# Altium schematic sheet 11-NCP3063_LCD背光.SchDoc
size A4; DocumentNumber: 30; SheetNumber: 30; SheetTotal: 30
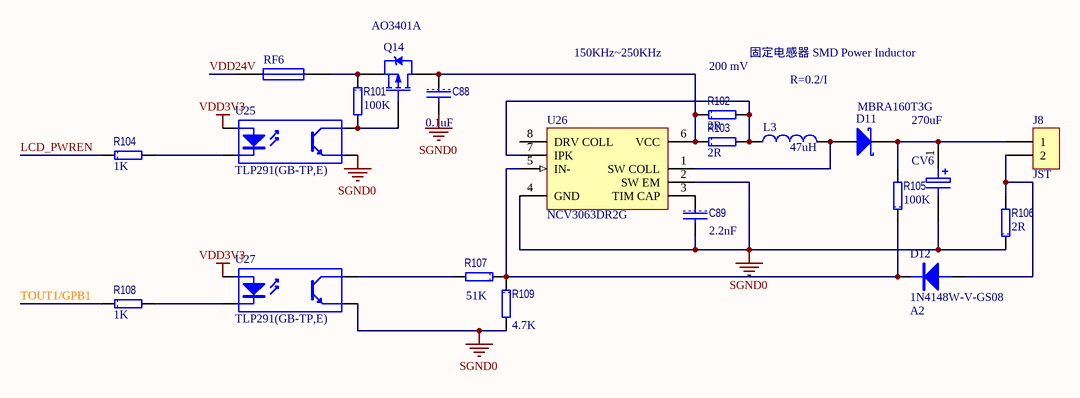
[diagram p0: 11-NCP3063_LCD背光.SchDoc]

## Parts
C88  value 0.1uF  [1608[0603]C]  (hidden comment: C1608X7R1H104K)
C89  value 2.2nF  [1608[0603]C]  (hidden comment: C1608X7R1H222K)
CV6  value 270uF  [CAPPR5-10x20/H1.1]  (hidden comment: EEU-FM1H271)
D11  MBRA160T3G  [DO-214AC/SMA]
D12  1N4148W-V-GS08  value A2  [SOD323]
J8  JST  [JST]
L3  value 47uH  [INDP5050X28N]  (hidden comment: CDRH5D28RH125NP-470MC)
Q14  AO3401A  [SOT23_N]
R101  value 100K  [1608[0603]R]  (hidden comment: CRCW0603100KFKEA)
R102  value 2R  [1608[0603]R]  (hidden comment: CRCW06032R00FKEA)
R103  value 2R  [1608[0603]R]  (hidden comment: CRCW06032R00FKEA)
R104  value 1K  [1608[0603]R]  (hidden comment: CRCW06031K00FKEA)
R105  value 100K  [1608[0603]R]  (hidden comment: CRCW0603100KFKEA)
R106  value 2R  [1608[0603]R]  (hidden comment: CRCW06032R00FKEA)
R107  value 51K  [1608[0603]R]  (hidden comment: CRCW060351K0FKEA)
R108  value 1K  [1608[0603]R]  (hidden comment: CRCW06031K00FKEA)
R109  value 4.7K  [1608[0603]R]  (hidden comment: CRCW06034K70FKEA)
RF6  1206L016WR  [3216[1206]]  (value not drawn)
U25  TLP291(GB-TP,E)  [SSOP4_N]
U26  NCV3063DR2G  [SOIC8_N]
U27  TLP291(GB-TP,E)  [SSOP4_N]

## Nets
SGND0: C88.2 C89.2 CV6.2 R106.1 R109.2 U25.3(E) U26.2(SW_EM) U26.4(GND) U27.3(E)
VDD3V3: U25.1(A) U27.1(A)
LCD_PWREN: R104.1
TOUT1/GPB1: R108.1
VDD24V: RF6.1
NetC88_1: C88.1 Q14.3(D) R102.1 R103.1 U26.6(VCC)
NetC89_1: C89.1 U26.3(TIM_CAP)
NetCV6_1: CV6.1 D11.2(K) J8.1 R105.2
NetD11_1: D11.1(A) L3.2 U26.1(SW_COLL)
NetD12_1: D12.1(A) J8.2 R106.2
NetD12_2: D12.2(K) R105.1 R107.1 R109.1 U26.5(IN-)
NetL3_1: L3.1 R102.2 R103.2 U26.7(IPK)
NetQ14_1: Q14.1(G) R101.2 U25.4(C)
NetQ14_2: Q14.2(S) R101.1 RF6.2
NetR104_2: R104.2 U25.2(K)
NetR107_2: R107.2 U27.4(C)
NetR108_2: R108.2 U27.2(K)

Not connected (* = marked no-connect by the designer): U26 8(DRV_COLL)

## Notes on the sheet
- 150KHz~250KHz
- (near R102) 200 mV
- R=0.2/I

## Library data of the parts
C88 = CAP: 多层陶瓷电容器MLCC - SMD/SMT 0603 0.1uF 50volts X7R 10%; Manufacturer: TDK; 产品: General Type MLCCs; 产品种类: Low & Medium Capacitance SMD Ceramic Chip Capacitors; 外壳代码 - in: 0603; 外壳代码 - mm: 1608; 封装 / 箱体: 0603 (1608 metric); 封装: Reel; 尺寸: 0.8 mm W x 1.6 mm L x 0.8 mm H; 工作温度范围: - 55 C to + 125 C; 标准包装数量: 4000; 电压额定值: 50 V; 电容-nF: 100 nF; 电容-pF: 100000 pF; 系列: C; Category: 多层陶瓷电容器MLCC - SMD/SMT; ComponentLink1Description: http://www.tdk.com/pdf/general_B11.pdf; ComponentLink1URL: http://www.tdk.com/pdf/general_B11.pdf; Description 1: 多层陶瓷电容器MLCC - SMD/SMT 0603 0.1uF 50volts X7R 10%; Manufacturer Part Number: C1608X7R1H104K; Minimum Order Quantity: 1; Pricing 1: 1=0.160, 50=0.070, 100=0.036, 500=0.019, 1000=0.013, 4000=0.010, 8000=0.009, 12000=0.008, 20000=0.007 (USD); Reeling: True; RoHS - 贸泽: Y; RoHS: RoHS Compliant; Stock 1: 224604; Supplier 1: Mouser; Supplier Part Number 1: 810-C1608X7R1H104K; 制造商: TDK; 容差: 10 %; 温度系数/代码: X7R; 电容: 0.1 uF; 端接类型: SMD/SMT
C89 = CAP: 多层陶瓷电容器MLCC - SMD/SMT 0603 2200pF 50volts X7R 10%; Manufacturer: TDK; 尺寸: 0.8 mm W x 1.6 mm L x 0.8 mm H; 工作温度范围: - 55 C to + 125 C; 封装 / 箱体: 0603 (1608 metric); 封装: Reel; 产品: General Type MLCCs; 系列: C; 电压额定值: 50 V; 电容-nF: 2.2 nF; 电容-uF: 0.0022 uF; 外壳代码 - in: 0603; 外壳代码 - mm: 1608; 产品种类: Low & Medium Capacitance SMD Ceramic Chip Capacitors; 标准包装数量: 4000; Product Status: End of Life; Supplier 1: Mouser; Supplier Part Number 1: 810-C1608X7R1H222K; Manufacturer Part Number: C1608X7R1H222K; RoHS: RoHS Compliant; Description 1: 多层陶瓷电容器MLCC - SMD/SMT 0603 2200pF 50volts X7R 10%; Category: 多层陶瓷电容器MLCC - SMD/SMT; Stock 1: 3940; Pricing 1: 1=0.100, 50=0.020, 100=0.014, 500=0.010, 1000=0.007, 4000=0.006, 8000=0.005, 20000=0.004 (USD); 电容: 2200 pF; 端接类型: SMD/SMT; 容差: 10 %; 制造商: TDK; 温度系数/代码: X7R; RoHS - 贸泽: Y; Minimum Order Quantity: 1; Reeling: True; ComponentLink1URL: http://www.tdk.com/pdf/general_B11.pdf; ComponentLink1Description: http://www.tdk.com/pdf/general_B11.pdf
CV6 = ELECTRO1: 插针 铝质电解电容器 - 带引线 270UF 50V ELECT FM RADIAL; Manufacturer: Panasonic Electronic Components; 工作温度范围: - 40 C to + 105 C; 封装: Bulk; 产品: Low Impedance Electrolytic Capacitors; 容差: 20 %; 外壳直径: 10 mm; 外壳长度: 20 mm; 损耗因数 DF: 0.1; 引线间隔: 5 mm; 加载寿命: 5000 hr; 制造商: Panasonic; 纹波电流: 1890 mA; 标准包装数量: 200; Supplier 1: Mouser; Supplier Part Number 1: 667-EEU-FM1H271; Manufacturer Part Number: EEU-FM1H271; RoHS: RoHS Compliant; Description 1: 铝质电解电容器 - 带引线 270UF 50V ELECT FM RADIAL; Category: 铝质电解电容器 - 带引线; Stock 1: 264; Pricing 1: 1=0.370, 25=0.334, 100=0.305, 250=0.281, 500=0.246, 1000=0.226, 2000=0.216, 5000=0.200 (USD); 电容: 270 uF; 系列: FM; 端接类型: Radial; 电压额定值: 50 V; RoHS - 贸泽: Y; Minimum Order Quantity: 1; Reeling: False; ComponentLink1URL: http://www.mouser.com/ds/2/315/ABA0000CE108-5973.pdf; ComponentLink1Description: http://www.mouser.com/ds/2/315/ABA0000CE108-5973.pdf
D11 = 10BQ060: 肖特基二极管与整流器 60 Volt 1.0 A; Manufacturer: ON Semiconductor; Configuration: Single; Forward Continuous Current: 2.1 A; Max Surge Current: 60 A; Forward Voltage Drop: 0.51 V at 1 A; Maximum Reverse Leakage Current: 200 uA; Peak Reverse Voltage: 60 V; Supplier 1: Mouser; Supplier Part Number 1: 863-MBRA160T3G; Manufacturer Part Number: MBRA160T3G; RoHS: RoHS Compliant; Category: Schottky Diodes & Rectifiers; Stock 1: 21130; Pricing 1: 1=0.756, 10=0.502, 100=0.281, 1000=0.211, 5000=0.181, 10000=0.170, 25000=0.155, 50000=0.150, 100000=0.144 (AUD); Operating Temperature Range: - 55 C to + 125 C; Package / Case: SMA; Packaging: Reel; Product: Schottky Diodes; Mounting Style: SMD/SMT; Product Category: Diodes- Schottky; Standard Pack Qty: 5000; RoHS - Mouser: Y; Minimum Order Quantity: 1; Reeling: True; ComponentLink1URL: http://www.mouser.com/ds/2/308/MBRA160T3-D-95572.pdf; ComponentLink1Description: http://www.mouser.com/ds/2/308/MBRA160T3-D-95572.pdf
D12 = 1N4148W: 二极管 - 通用，功率，开关 100V Io/150mA; Manufacturer: Vishay Semiconductors; 配置: Single; 工作温度范围: - 65 C to + 150 C; 封装 / 箱体: SOD-123; 封装: Reel; 产品: Switching Diodes; 正向连续电流: 0.15 A; 最大浪涌电流: 0.5 A; 安装风格: SMD/SMT; 恢复时间: 4 ns; 正向电压下降: 1.2 V; 制造商: Vishay; 最大二极管电容: 4 pF; 最大工作温度: + 150 C; 最大功率耗散: 350 mW; 最大反向漏泄电流: 5 uA; 最小工作温度: - 65 C; 标准包装数量: 15000; Supplier 1: Mouser; Supplier Part Number 1: 625-1N4148W-V; Manufacturer Part Number: 1N4148W-V-GS08; RoHS: RoHS Compliant; Category: 二极管 - 通用，功率，开关; Stock 1: 404148; Pricing 1: 1=0.090, 10=0.083, 50=0.072, 100=0.068, 500=0.032, 1000=0.026, 3000=0.021, 9000=0.016, 10000=0.016, 18000=0.014 (USD); 峰值反向电压: 100 V; 产品种类: Switching Diodes; RoHS - 贸泽: Y; Minimum Order Quantity: 1; Reeling: True; ComponentLink1URL: http://www.mouser.com/ds/2/427/1n4148w--240387.pdf; ComponentLink1Description: http://www.mouser.com/ds/2/427/1n4148w--240387.pdf; Description 1: 二极管 - 通用，功率，开关 100V Io/150mA
J8 = CON2: CON
L3 = Inductor: 固定电感器 SMD Power Inductor; Manufacturer: Sumida; 尺寸: 6.2 mm W x 6.3 mm L x 3 mm H; 电感: 47 uH; 最大直流电流: 0.91 A; 最大直流电阻: 500 mOhms; 工作温度范围: - 40 C to + 125 C; 封装: Reel; 产品: SMD Power Inductors; 系列: CDRH; 屏蔽: Shielded; 端接类型: SMD/SMT; 容差: 20 %; 外壳高度: 3 mm; 外壳长度: 6.3 mm; 外壳宽度: 6.2 mm; Product Status: New Product; Supplier 1: Mouser; Supplier Part Number 1: 851-CDRH5D28RH125470; Manufacturer Part Number: CDRH5D28RH125NP-470MC; RoHS: RoHS Compliant; Description 1: 固定电感器 SMD Power Inductor; Category: 固定电感器; Stock 1: 3441; Pricing 1: 1=0.950, 10=0.920, 100=0.650, 500=0.640, 1000=0.620, 2000=0.600, 4000=0.470 (USD); 制造商: Sumida; RoHS - 贸泽: Y; Minimum Order Quantity: 1; Reeling: True; ComponentLink1URL: http://www.mouser.com/ds/2/390/CDRH5D28RH125-4194.pdf; ComponentLink1Description: http://www.mouser.com/ds/2/390/CDRH5D28RH125-4194.pdf
Q14 = IRLML5103: MOSFET P-CH -30V -4.3A SOT23; Manufacturer: Alpha & Omega Semiconductor Inc; FET Type: MOSFET P-Channel, Metal Oxide; FET Feature: Logic Level Gate, 2.5V Drive; Drain to Source Voltage (Vdss): 30V; Current - Continuous Drain (Id) @ 25° C: 4.3A (Ta); Rds On (Max) @ Id, Vgs: 44 mOhm @ 4.3A, 10V; Vgs(th) (Max) @ Id: 1.3V @ 250μA; Gate Charge (Qg) @ Vgs: 12.2nC @ 4.5V; Input Capacitance (Ciss) @ Vds: 1200pF @ 15V; Power - Max: 1.4W; Supplier 1: Digi-Key; Supplier Part Number 1: 785-1001-6-ND; Manufacturer Part Number: AO3401A; RoHS: RoHS Compliant; Description 1: MOSFET P-CH -30V -4.3A SOT23; Category: Discrete Semiconductor Products; Stock 1: 75922; Pricing 1: 1=0.48, 25=0.2792, 100=0.225, 250=0.162, 500=0.1305, 1000=0.10125 (USD); Packaging: Digi-Reel?; Mounting Type: Surface Mount; Package / Case: TO-236-3, SC-59, SOT-23-3; Supplier Device Package: SOT-23-3; ComponentLink1URL: http://www.aosmd.com/res/data_sheets/AO3401A.pdf; ComponentLink1Description: http://www.aosmd.com/res/data_sheets/AO3401A.pdf
R101 R105 = RES: 厚膜电阻器 - SMD 1/10watt 100Kohms 1%; Manufacturer: Vishay / Dale; 尺寸: 0.85 mm W x 1.55 mm L x 0.45 mm H; 工作温度范围: - 55 C to + 155 C; 封装 / 箱体: 0603 (1608 metric); 封装: Reel; 功率额定值: 100 mW; 产品: Thick Film Resistors SMD; 系列: CRCW; 温度系数: 100 PPM / K; 端接类型: SMD/SMT; 电压额定值: 75 V; 制造商: Vishay; 产品种类: 0603 Thick Film Chip Resistors; 标准包装数量: 5000; 外壳代码 - in: 0603; 外壳代码 - mm: 1608; Supplier 1: Mouser; Supplier Part Number 1: 71-CRCW0603-100K-E3; Manufacturer Part Number: CRCW0603100KFKEA; RoHS: RoHS Compliant By Exemption; Category: 厚膜电阻器 - SMD; Stock 1: 175756; Pricing 1: 1=0.080, 10=0.013, 100=0.010, 1000=0.008, 5000=0.005, 25000=0.004, 50000=0.003 (USD); 电阻: 100 kOhms; 容差: 1 %; RoHS - 贸泽: E; Minimum Order Quantity: 1; Reeling: True; ComponentLink1URL: http://www.mouser.com/ds/2/427/dcrcwe3-109170.pdf; ComponentLink1Description: http://www.mouser.com/ds/2/427/dcrcwe3-109170.pdf; Description 1: 厚膜电阻器 - SMD 1/10watt 100Kohms 1%
R102 R103 R106 = RES: 厚膜电阻器 - SMD 1/10watt 2ohms 1%; Manufacturer: Vishay / Dale; 尺寸: 0.85 mm W x 1.55 mm L x 0.45 mm H; 工作温度范围: - 55 C to + 155 C; 封装 / 箱体: 0603 (1608 metric); 封装: Reel; 功率额定值: 100 mW; 产品: Thick Film Resistors SMD; 系列: CRCW; 温度系数: 100 PPM / K; 端接类型: SMD/SMT; 电压额定值: 75 V; 外壳代码 - in: 0603; 外壳代码 - mm: 1608; 制造商: Vishay; 产品种类: 0603 Thick Film Chip Resistors; Product Status: New at Mouser; Supplier 1: Mouser; Supplier Part Number 1: 71-CRCW06032R00FKEA; Manufacturer Part Number: CRCW06032R00FKEA; RoHS: RoHS Compliant By Exemption; Category: 厚膜电阻器 - SMD; Stock 1: 9213; Pricing 1: 1=0.080, 10=0.013, 100=0.010, 1000=0.008, 5000=0.005, 25000=0.004, 50000=0.003 (USD); 电阻: 2 Ohms; 容差: 1 %; RoHS - 贸泽: E; Minimum Order Quantity: 1; Reeling: True; ComponentLink1URL: http://www.mouser.com/ds/2/427/dcrcwe3-109170.pdf; ComponentLink1Description: http://www.mouser.com/ds/2/427/dcrcwe3-109170.pdf; Description 1: 厚膜电阻器 - SMD 1/10watt 2ohms 1%
R104 R108 = RES: 厚膜电阻器 - SMD 1/10watt 1.0Kohms 1%; Manufacturer: Vishay / Dale; 尺寸: 0.85 mm W x 1.55 mm L x 0.45 mm H; 工作温度范围: - 55 C to + 155 C; 封装 / 箱体: 0603 (1608 metric); 封装: Reel; 功率额定值: 100 mW; 产品: Thick Film Resistors SMD; 电阻: 1 kOhms; 系列: CRCW; 温度系数: 100 PPM / K; 端接类型: SMD/SMT; 电压额定值: 75 V; 制造商: Vishay; 产品种类: 0603 Thick Film Chip Resistors; 标准包装数量: 5000; 外壳代码 - in: 0603; 外壳代码 - mm: 1608; Supplier 1: Mouser; Supplier Part Number 1: 71-CRCW0603-1.0K-E3; Manufacturer Part Number: CRCW06031K00FKEA; RoHS: RoHS Compliant By Exemption; Category: 厚膜电阻器 - SMD; Stock 1: 276938; Pricing 1: 1=0.080, 10=0.013, 100=0.010, 1000=0.008, 5000=0.005, 25000=0.004, 50000=0.003 (USD); 容差: 1 %; RoHS - 贸泽: E; Minimum Order Quantity: 1; Reeling: True; ComponentLink1URL: http://www.mouser.com/ds/2/427/dcrcwe3-109170.pdf; ComponentLink1Description: http://www.mouser.com/ds/2/427/dcrcwe3-109170.pdf; Description 1: 厚膜电阻器 - SMD 1/10watt 1.0Kohms 1%
R107 = RES: 厚膜电阻器 - SMD 1/10watt 51Kohms 1%; Manufacturer: Vishay / Dale; 尺寸: 0.85 mm W x 1.55 mm L x 0.45 mm H; 工作温度范围: - 55 C to + 155 C; 封装 / 箱体: 0603 (1608 metric); 封装: Reel; 功率额定值: 100 mW; 产品: Thick Film Resistors SMD; 系列: CRCW; 温度系数: 100 PPM / K; 端接类型: SMD/SMT; 电压额定值: 75 V; 外壳代码 - in: 0603; 外壳代码 - mm: 1608; 制造商: Vishay; 产品种类: 0603 Thick Film Chip Resistors; 标准包装数量: 5000; Supplier 1: Mouser; Supplier Part Number 1: 71-CRCW0603-51K-E3; Manufacturer Part Number: CRCW060351K0FKEA; RoHS: RoHS Compliant By Exemption; Description 1: 厚膜电阻器 - SMD 1/10watt 51Kohms 1%; Category: 厚膜电阻器 - SMD; Stock 1: 17039; Pricing 1: 1=0.080, 10=0.013, 100=0.010, 1000=0.008, 5000=0.005, 25000=0.004, 50000=0.003 (USD); 电阻: 51 kOhms; 容差: 1 %; RoHS - 贸泽: E; Minimum Order Quantity: 1; Reeling: True; ComponentLink1URL: http://www.mouser.com/ds/2/427/dcrcwe3-109170.pdf; ComponentLink1Description: http://www.mouser.com/ds/2/427/dcrcwe3-109170.pdf
R109 = RES: 厚膜电阻器 - SMD 1/10watt 4.7Kohms 1%; Manufacturer: Vishay / Dale; 尺寸: 0.85 mm W x 1.55 mm L x 0.45 mm H; 工作温度范围: - 55 C to + 155 C; 封装 / 箱体: 0603 (1608 metric); 封装: Reel; 功率额定值: 100 mW; 产品: Thick Film Resistors SMD; 系列: CRCW; 温度系数: 100 PPM / K; 端接类型: SMD/SMT; 电压额定值: 75 V; 外壳代码 - in: 0603; 外壳代码 - mm: 1608; 制造商: Vishay; 产品种类: 0603 Thick Film Chip Resistors; 标准包装数量: 5000; Supplier 1: Mouser; Supplier Part Number 1: 71-CRCW0603-4.7K-E3; Manufacturer Part Number: CRCW06034K70FKEA; RoHS: RoHS Compliant By Exemption; Description 1: 厚膜电阻器 - SMD 1/10watt 4.7Kohms 1%; Category: 厚膜电阻器 - SMD; Stock 1: 71637; Pricing 1: 1=0.080, 10=0.013, 100=0.010, 1000=0.008, 5000=0.005, 25000=0.004, 50000=0.003 (USD); 电阻: 4.7 kOhms; 容差: 1 %; RoHS - 贸泽: E; Minimum Order Quantity: 1; Reeling: True; ComponentLink1URL: http://www.mouser.com/ds/2/427/dcrcwe3-109170.pdf; ComponentLink1Description: http://www.mouser.com/ds/2/427/dcrcwe3-109170.pdf
RF6 = FUSE1: 可复位保险丝 PTC 30V POLY SURF MOUNT 1206 .160A; Manufacturer: LITTELFUSE; Holding Current: 160; Tripping Current: 370; Initial Resistance Max: 4.5; Operating Voltage: 30; PTC Fuse Case: 1206; External Depth: 1.45; Initial Resistance Min: 1.2; Supplier 1: Newark; Supplier Part Number 1: 05M2299; Manufacturer Part Number: 1206L016WR; RoHS: YES; Stock 1: 642; Pricing 1: 1=0.45, 10=0.41, 100=0.3, 250=0.27, 500=0.221, 1000=0.21, 2000=0.181, 4000=0.18 (USD); Series: POLYFUSE; ComponentLink1URL: http://www.littelfuse.com/data/en/Data_Sheets/Littelfuse_PTC_1206L.pdf; ComponentLink1Description: http://www.littelfuse.com/data/en/Data_Sheets/Littelfuse_PTC_1206L.pdf
U25 U27 = Optoisolator1: 晶体管输出光电耦合器 80Vceo 2500Vrms standard; Manufacturer: Toshiba; Manufacturer Part Number: TLP281(GB-TP,F); 输出设备: NPN Phototransistor; 输出类型: DC; 封装 / 箱体: SOP-4; 封装: Reel; 电流传递比: 600 %; 最大集电极电流: 50 mA; 最大集电极/发射极饱和电压: 0.4 V; 最大集电极/发射极电压: 80 V; 最大下降时间: 3 us; 最大正向二极管电压: 1.3 V; 最大工作温度: + 100 C; 最大功率耗散: 200 mW; 最大反向二极管电压: 5 V; 最大上升时间: 2 us; 最小工作温度: - 55 C; 每芯片的通道数量: 1 Channel; 产品种类: Opto - Photocouplers; 标准包装数量: 2500; Product Status: End of Life; Supplier 1: Mouser; Supplier Part Number 1: 757-TLP281(GB-TP,F); RoHS: RoHS Compliant; Description 1: 晶体管输出光电耦合器 80Vceo 2500Vrms standard; Category: 晶体管输出光电耦合器; Stock 1: 56577; Pricing 1: 1=0.810, 10=0.636, 100=0.412, 1000=0.330, 2500=0.270, 10000=0.259, 25000=0.250 (USD); 绝缘电压: 2500 Vrms; 制造商: Toshiba; 最大输入二极管电流: 50 mA; RoHS - 贸泽: Y; Minimum Order Quantity: 1; Reeling: True; ComponentLink1URL: http://www.mouser.com/ds/2/408/4195-37827.pdf; ComponentLink1Description: http://www.mouser.com/ds/2/408/4195-37827.pdf
U26 = MC33063AD: 直流/直流开关转换器 1.5 A DCDC SW REG; Manufacturer: ON Semiconductor; 工作温度范围: - 40 C to + 125 C; 封装 / 箱体: SOIC-8; 封装: Reel; 类型: DC/DC Switching - Converters; 安装风格: SMD/SMT; 开关频率: 150 kHz; 产品种类: DC-DC Switching- Controllers; 标准包装数量: 2500; Supplier 1: Mouser; Supplier Part Number 1: 863-NCV3063DR2G; Manufacturer Part Number: NCV3063DR2G; RoHS: RoHS Compliant; Description 1: 直流/直流开关转换器 1.5 A DCDC SW REG; Category: 直流/直流开关转换器; Stock 1: 0; Pricing 1: 1620=0.589, 2000=0.532, 2500=0.532, 5000=0.505, 10000=0.486, 25000=0.470 (USD); 制造商: ON Semiconductor; RoHS - 贸泽: Y; Minimum Order Quantity: 1620; Reeling: True; ComponentLink1URL: http://www.mouser.com/ds/2/308/NCP3063-D-46986.pdf; ComponentLink1Description: http://www.mouser.com/ds/2/308/NCP3063-D-46986.pdf